# EasyEDA schematic Pratica 00.json
TITLE: Sheet_1; REV: 1.0; Date: 2021-07-17; Sheet: 1/1; Drawn By: Davi de Pontes Pasquini; Company: Your Company
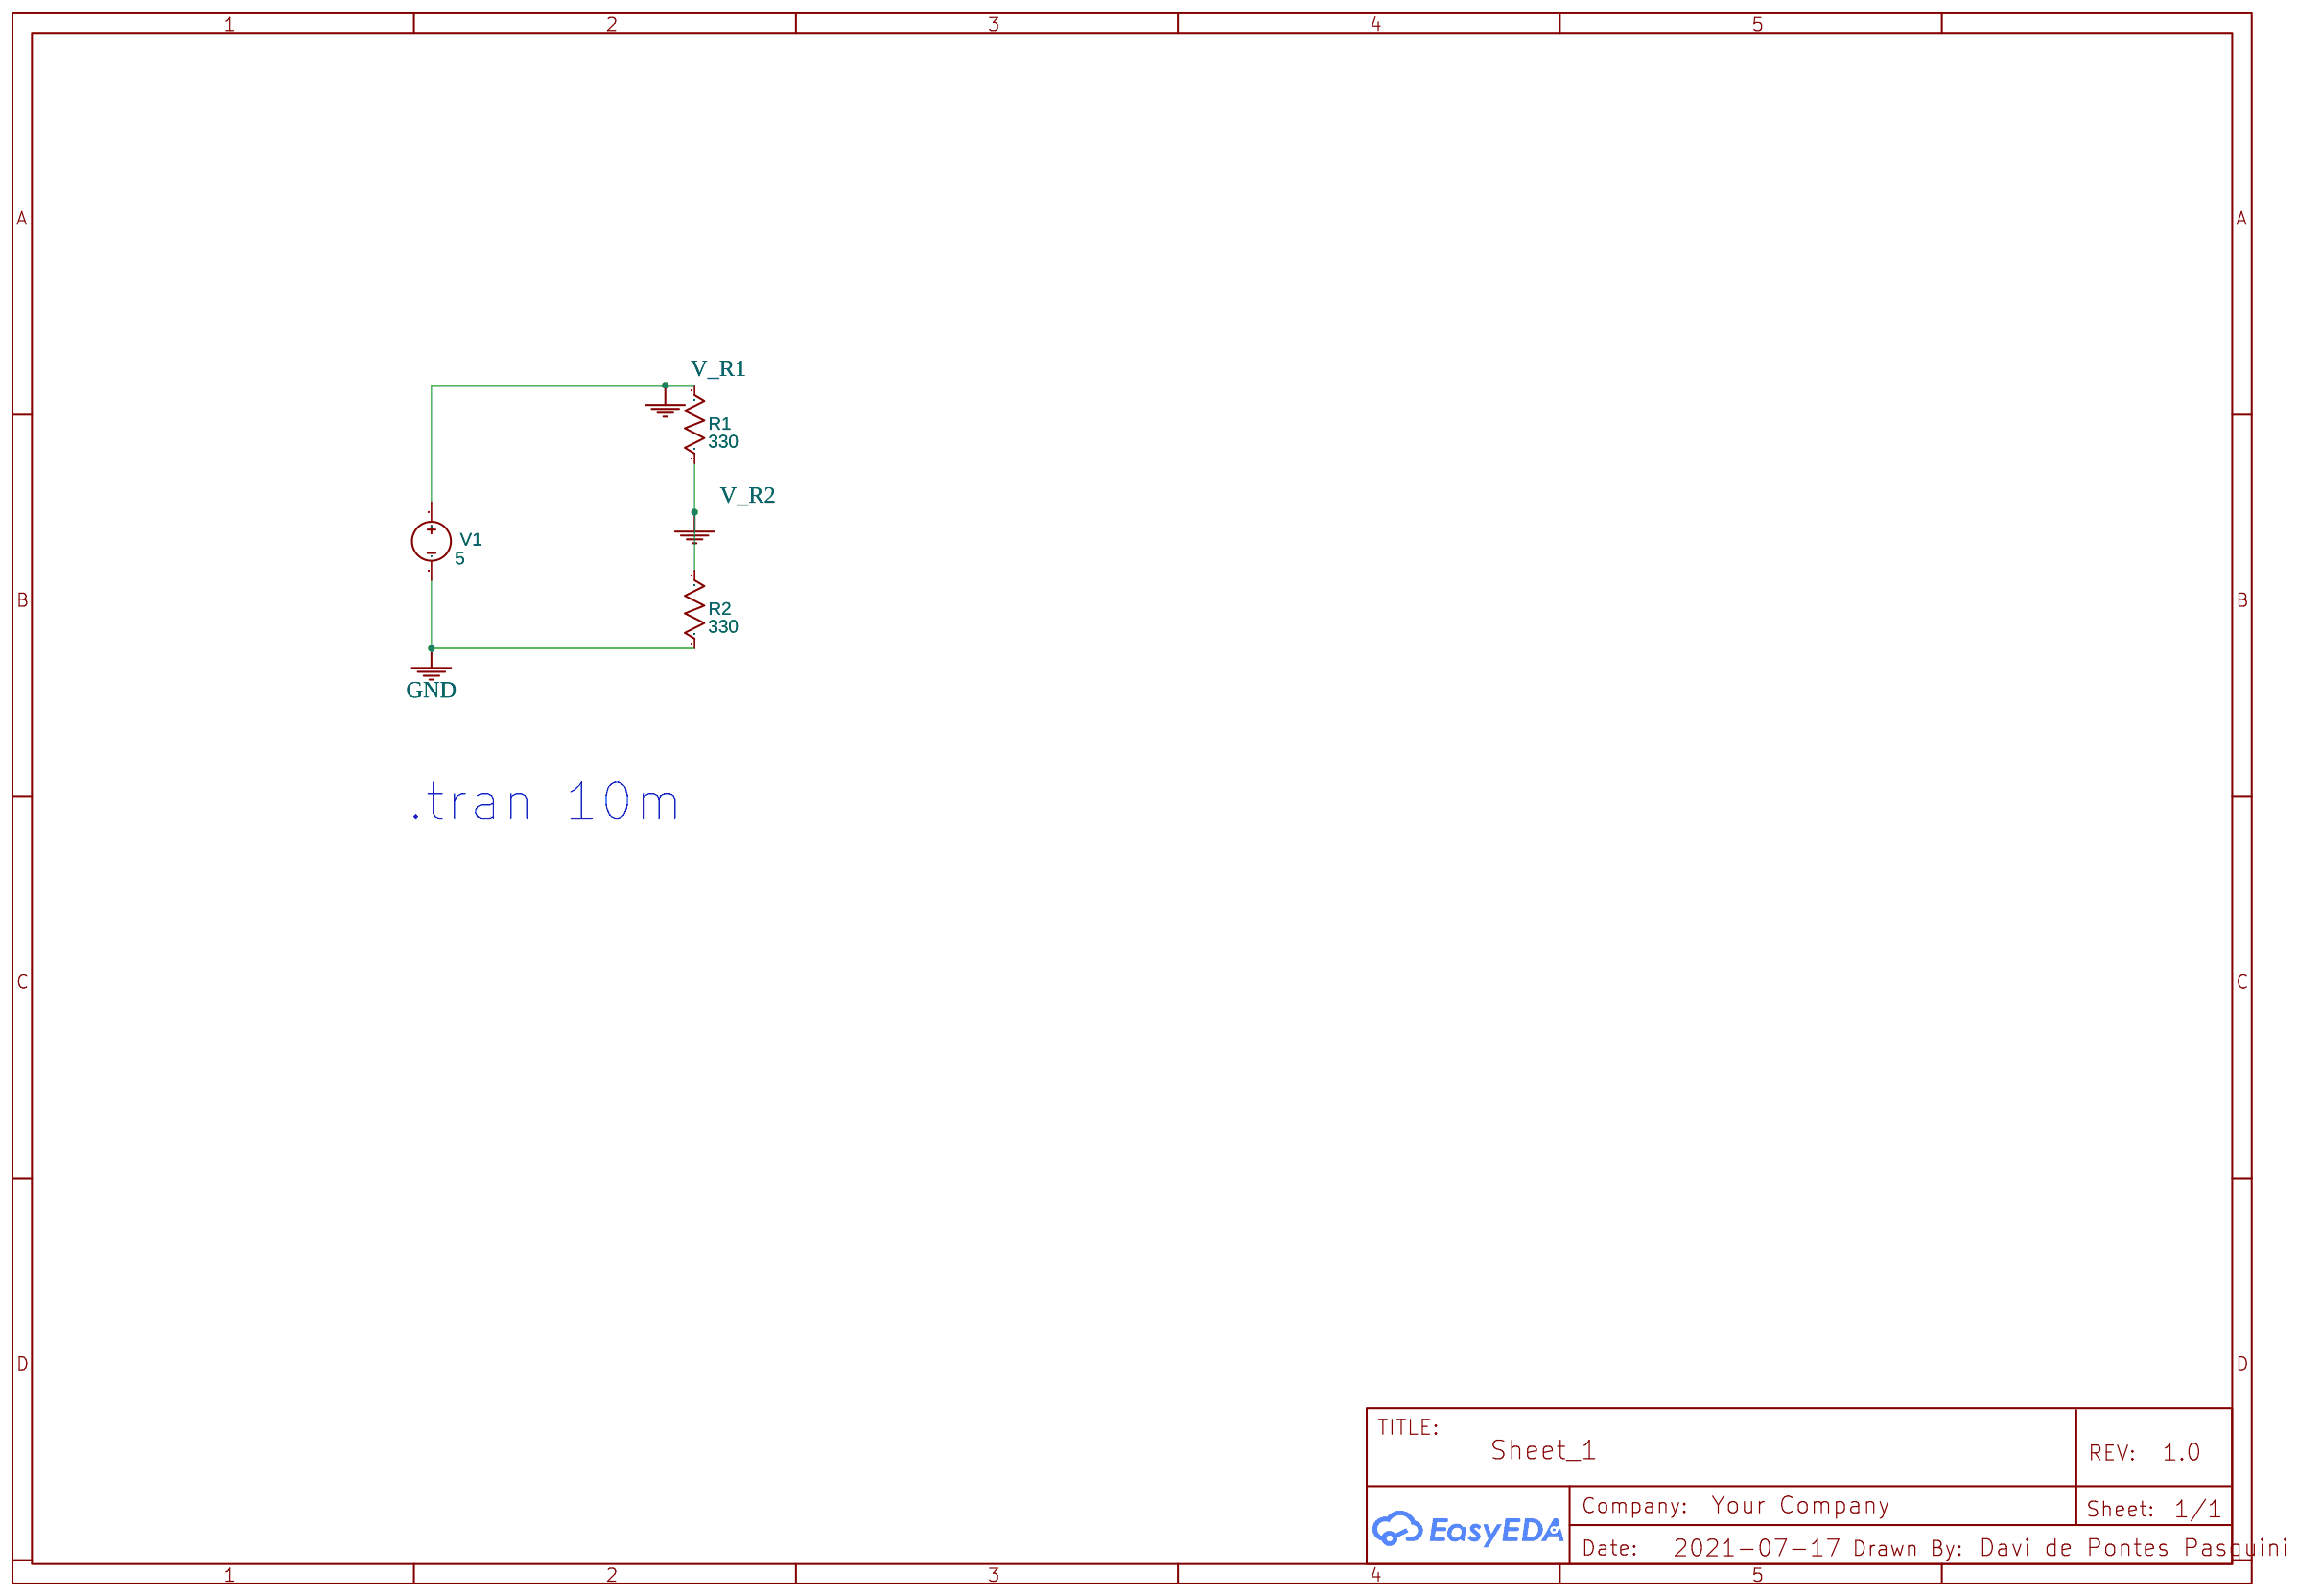
[diagram p0: schematic sheet]

## Parts
R1  330  [AXIAL-0.3]
R2  330  [AXIAL-0.3]
V1  5  [HDR1X2]

## Library data of the parts
R1 R2 = Resistor_US: Resistance: 1k; Contributor: EasyEDA; Supplier: YUJING
V1 = VDC: Contributor: EasyEDA; sim: true

## Nets
GND: R2.1 V1.2
V_R1: R1.2 V1.1
V_R2: R1.1 R2.2

## Notes on the sheet
- .tran 10m
